# Altium schematic sheet B100AA - Block Diagram.SchDoc: B100AA Block Diagram
size A3; SheetNumber: 1
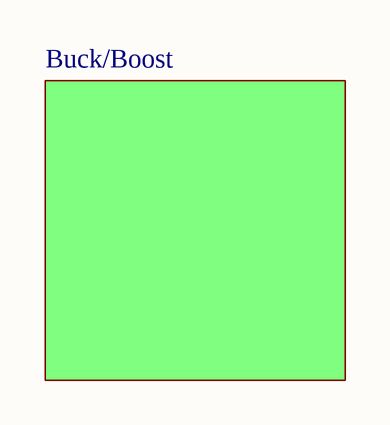
[diagram p0: B100AA - Block Diagram.SchDoc]

## Sub-sheets
Buck/Boost = Buck Boost Converter.SchDoc: no entries

## Notes on the sheet
- Title
- Size:
- Date:
- A3
- Number:
- Time:
- Revision:
- Sheet
- of
- File: